# EAGLE design SEM V1 (EAGLE 9.6.2)
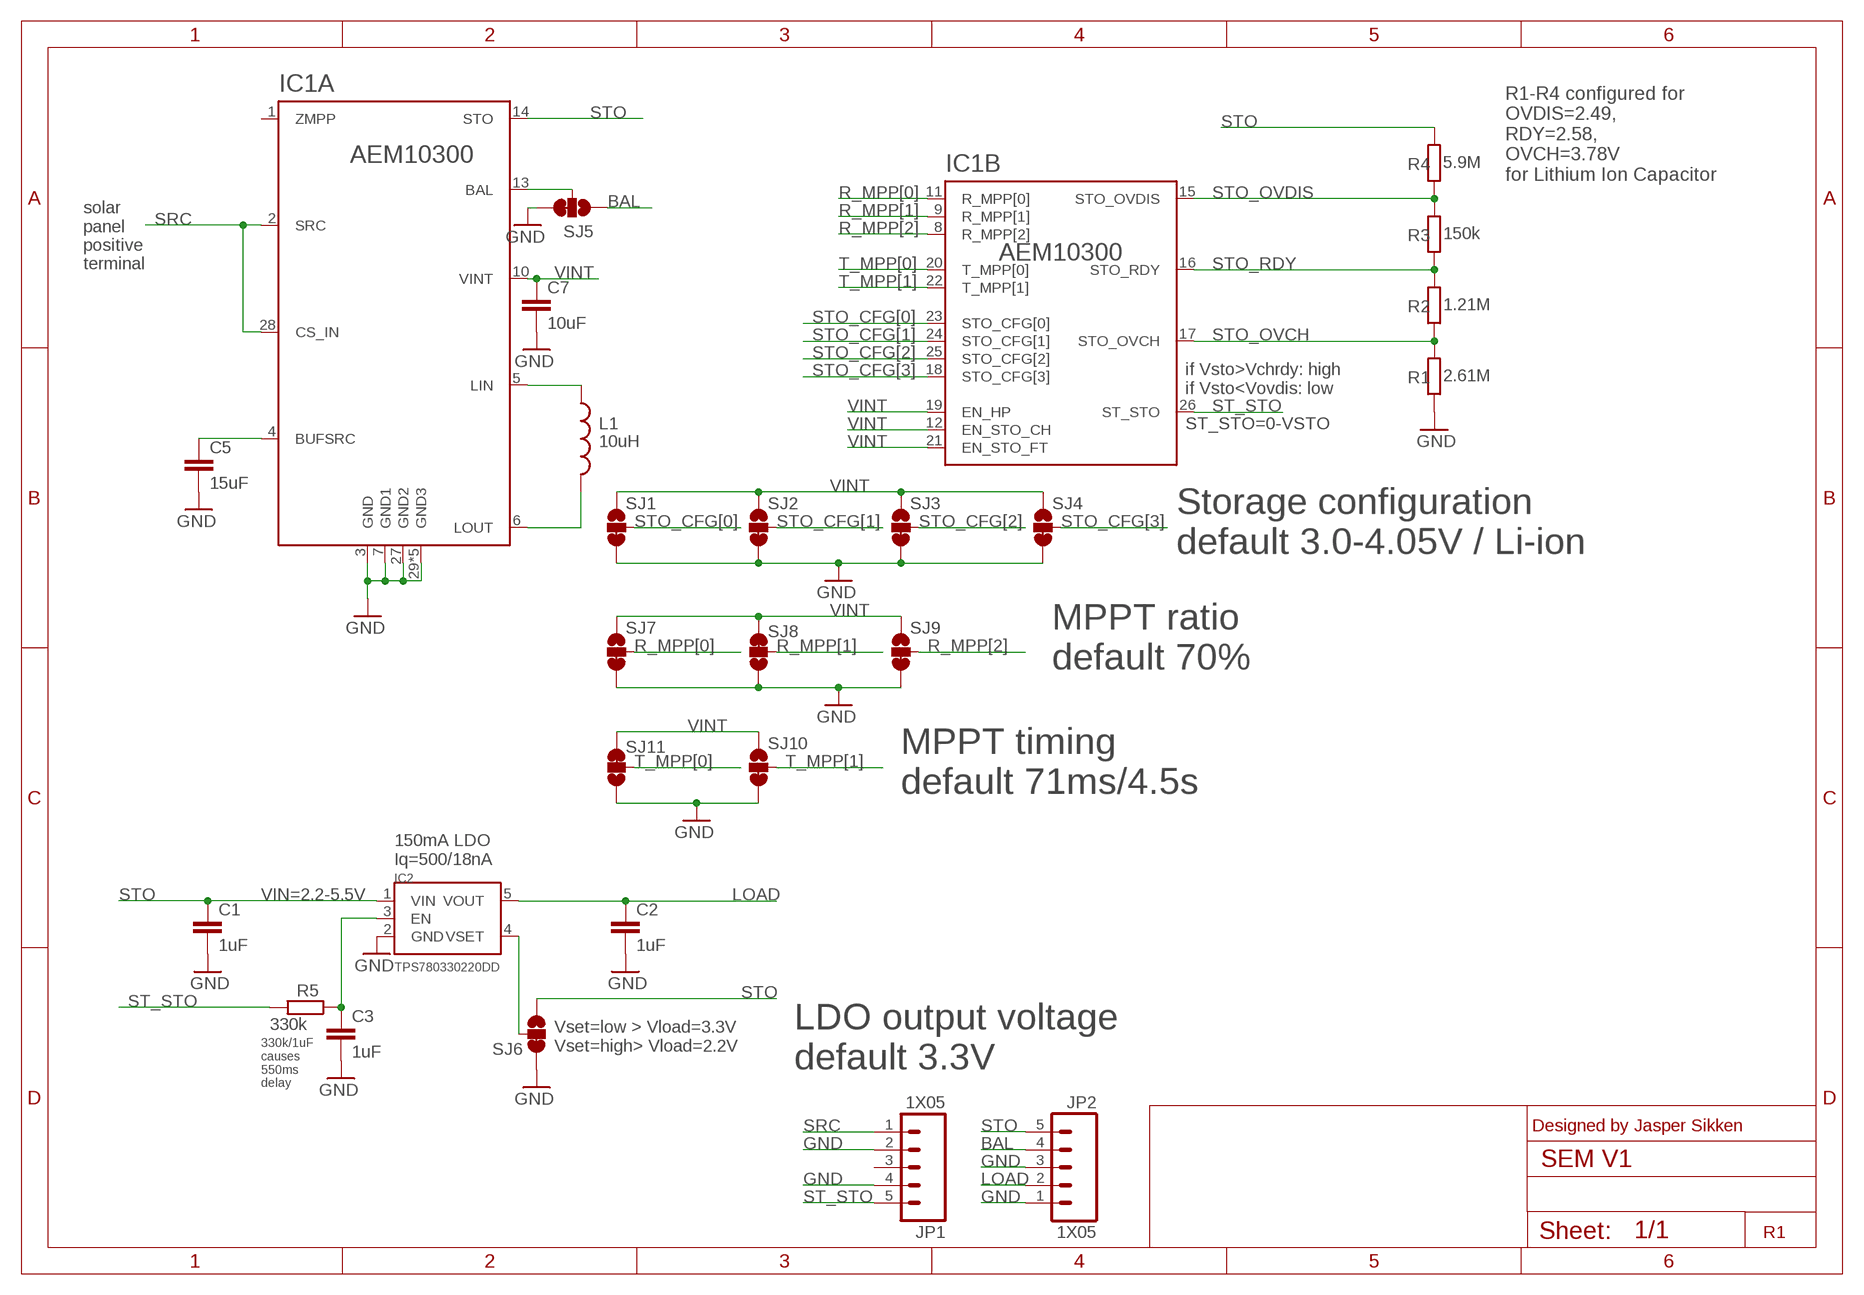
[diagram p0: schematic, sheet 1]

## Parts
C1  1uF  C0402_1UF  [C0402]
C2  1uF  C0402_1UF  [C0402]
C3  1uF  C_0402  [C0402]
C5  15uF  C_0402  [C0402]
C7  10uF  C_0402  [C0402]
IC1  AEM10300  [QFN28P4X4]
IC2  TPS780330220DD  [SOT23-5]
JP1  1X05  [1X05_2.54MM_ROUND_NOSILK]
JP2  1X05  [1X05_2.54MM_ROUND_NOSILK]
L1  10uH  L  [L_1008_[2520]]
R1  2.61M  R0402_1M  [R0402]
R2  1.21M  R0402_1M  [R0402]
R3  150k  R0402_1M  [R0402]
R4  5.9M  R0402_1M  [R0402]
R5  330k  R0402_1M  [R0402]
SJ1  SOLDERJUMPER_3WAY_12SHORT3WAY  [SJ_3S_NC_0402]
SJ2  SOLDERJUMPER_3WAY_12SHORT3WAY  [SJ_3S_NC_0402]
SJ3  SOLDERJUMPER_3WAY_12SHORT3WAY  [SJ_3S_NC_0402]
SJ4  SOLDERJUMPER_3WAY_12SHORT3WAY  [SJ_3S_NC_0402]
SJ5  SOLDERJUMPER_3WAY_12SHORT3WAY  [SJ_3S_NC_0402]
SJ6  SOLDERJUMPER_3WAY_12SHORT3WAY  [SJ_3S_NC_0402]
SJ7  SOLDERJUMPER_3WAY_12SHORT3WAY  [SJ_3S_NC_0402]
SJ8  SOLDERJUMPER_3WAY_12SHORT3WAY  [SJ_3S_NC_0402]
SJ9  SOLDERJUMPER_3WAY_12SHORT3WAY  [SJ_3S_NC_0402]
SJ10  SOLDERJUMPER_3WAY_12SHORT3WAY  [SJ_3S_NC_0402]
SJ11  SOLDERJUMPER_3WAY_12SHORT3WAY  [SJ_3S_NC_0402]

## Nets
AEM_BAL: IC1.13(A:BAL) SJ5.2
BAL: JP2.4 SJ5.3
BUFSRC: C5.1 IC1.4(A:BUFSRC)
EN: C3.1 IC2.3(EN) R5.1
GND: C1.2 C2.2 C3.2 C5.2 C7.2 IC1.3(A:GND) IC1.7(A:GND1) IC1.27(A:GND2) IC1.29(A:GND3) IC1.P$1(A:GND3) IC1.P$2(A:GND3) IC1.P$3(A:GND3) IC1.P$4(A:GND3) IC2.2(GND) JP1.2 JP1.4 JP2.1 JP2.3 R1.1 SJ1.1 SJ2.1 SJ3.1 SJ4.1 SJ5.1 SJ6.1 SJ7.1 SJ8.3 SJ9.1 SJ10.1 SJ11.3
LIN: IC1.5(A:LIN) L1.1
LOAD: C2.1 IC2.5(VOUT) JP2.2
LOUT: IC1.6(A:LOUT) L1.2
R_MPP[0]: IC1.11(B:R_MPP[0]) SJ7.2
R_MPP[1]: IC1.9(B:R_MPP[1]) SJ8.2
R_MPP[2]: IC1.8(B:R_MPP[2]) SJ9.2
SRC: IC1.2(A:SRC) IC1.28(A:CS_IN) JP1.1
ST_STO: IC1.26(B:ST_STO) JP1.5 R5.2
STO: C1.1 IC1.14(A:STO) IC2.1(VIN) JP2.5 R4.2 SJ6.3
STO_CFG[0]: IC1.23(B:STO_CFG[0]) SJ1.2
STO_CFG[1]: IC1.24(B:STO_CFG[1]) SJ2.2
STO_CFG[2]: IC1.25(B:STO_CFG[2]) SJ3.2
STO_CFG[3]: IC1.18(B:STO_CFG[3]) SJ4.2
STO_OVCH: IC1.17(B:STO_OVCH) R1.2 R2.1
STO_OVDIS: IC1.15(B:STO_OVDIS) R3.2 R4.1
STO_RDY: IC1.16(B:STO_RDY) R2.2 R3.1
T_MPP[0]: IC1.20(B:T_MPP[0]) SJ11.2
T_MPP[1]: IC1.22(B:T_MPP[1]) SJ10.2
VINT: C7.1 IC1.10(A:VINT) IC1.12(B:EN_STO_CH) IC1.19(B:EN_HP) IC1.21(B:EN_STO_FT) SJ1.3 SJ2.3 SJ3.3 SJ4.3 SJ7.3 SJ8.1 SJ9.3 SJ10.3 SJ11.1
VSET: IC2.4(VSET) SJ6.2
Unconnected: IC1.1(A:ZMPP) JP1.3

## Notes on the sheet
- R1-R4 configured for 
  OVDIS=2.49,
  RDY=2.58,
  OVCH=3.78V
  for Lithium Ion Capacitor
- solar
  panel
  positive
  terminal
- if Vsto>Vchrdy: high
  if Vsto<Vovdis: low
- ST_STO=0-VSTO
- Storage configuration
  default 3.0-4.05V / Li-ion
- MPPT ratio
  default 70%
- MPPT timing
  default 71ms/4.5s
- 150mA LDO 
  Iq=500/18nA
- VIN=2.2-5.5V
- Vset=low > Vload=3.3V
  Vset=high> Vload=2.2V
- LDO output voltage
  default 3.3V
- 330k/1uF 
  causes 
  550ms 
  delay
- Designed by Jasper Sikken
- R1

## Library data of the parts
C1 C2 = TSEM:C: Non-polarized capacitor; FARNELL_OC: 2672103
C3 C5 C7 = TSEM:C: Non-polarized capacitor
IC1 = TSEM:AEM10300: Ambient Energy Manager from e-peas
IC2 = TSEM:TPS780330220DD
JP1 JP2 = TSEM:1X05; OC_NEWARK: unknown
L1 = TSEM:L: Inductor; MF: MURATA; MPN: DFE252010F-100
R1-R5 = TSEM:R: Resistor; FARNELL_OC: 2502499; OC_NEWARK: unknown; VALUE: 1M
SJ1-SJ11 = sodaq:SOLDERJUMPER_3WAY_12SHORT; OC_NEWARK: unknown

## Board
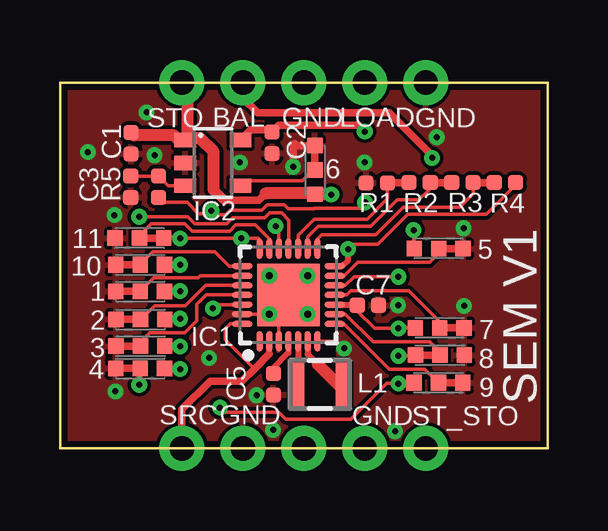
[diagram p1: board, top side]
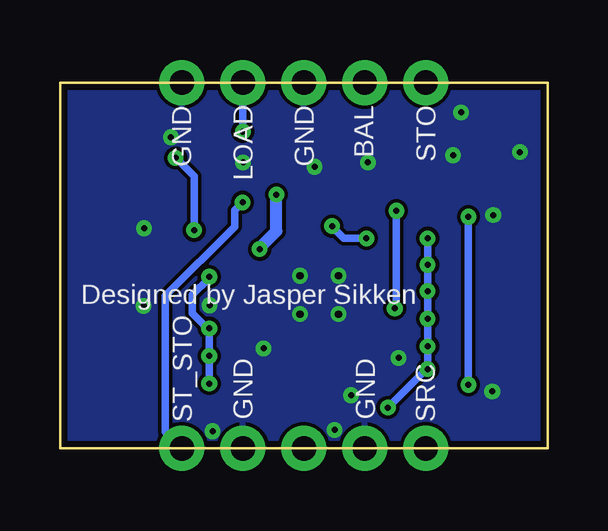
[diagram p2: board, bottom side, seen from below]

Size 20.32 x 15.24 mm. Coordinates in mm from the lower left corner, seen from the top.
Outline: 0,0 0,15.24 20.32,15.24 20.32,0 0,0
Copper layers (1*16): Top 0.018mm / dielectric 1.55mm / Bottom 0.018mm
Design rules "eC_2Layer_PClass6_BaseCopperO18_eCDefault *": minimum track width 0.15mm, minimum drill 0.25mm, track to track 0.15mm, track to pad 0.15mm, pad to pad 0.15mm, via to via 0.15mm, smd to smd 0mil, copper to edge 0.25mm, drill to drill 0.35mm, minimum pad ring 0.175mm, minimum via ring 0.125mm, stop-mask expansion 0.03mm, vias tented up to drill 0.45mm, thermal gap 0.15mm
tRestrict: area 10.6,3.5 to 11.4,4.9

### Footprints (pad centres in the part's own frame; a part is rotated, then mirrored left to right if it is on the bottom)
C0402 = smd 0.635 x 0.635: 1 -0.445,0; 2 0.445,0
QFN28P4X4 = smd 0.85 x 0.25: 1 -1.925,1.2; 2 -1.925,0.8; 3 -1.925,0.4; 4 -1.925,0; 5 -1.925,-0.4; 6 -1.925,-0.8; 7 -1.925,-1.2; 15 1.925,-1.2; 16 1.925,-0.8; 17 1.925,-0.4; 18 1.925,0; 19 1.925,0.4; 20 1.925,0.8; 21 1.925,1.2 | smd 0.25 x 0.85: 8 -1.2,-1.925; 9 -0.8,-1.925; 10 -0.4,-1.925; 11 0,-1.925; 12 0.4,-1.925; 13 0.8,-1.925; 14 1.2,-1.925; 22 1.2,1.925; 23 0.8,1.925; 24 0.4,1.925; 25 0,1.925; 26 -0.4,1.925; 27 -0.8,1.925; 28 -1.2,1.925 | smd 2.6 x 2.6: 29 0,0 | drill 0.3: P$1 -0.8,0.8; P$2 0.8,0.8; P$3 -0.8,-0.8; P$4 0.8,-0.8
SOT23-5 = smd 0.6 x 0.9: 1 -0.95,-1.15; 2 0,-1.15; 3 0.95,-1.15; 4 0.95,1.15; 5 -0.95,1.15
1X05_2.54MM_ROUND_NOSILK = drill 1.016 pad 1.88: 1 0,0; 2 2.54,0; 3 5.08,0; 4 7.62,0; 5 10.16,0
L_1008_[2520] = smd 0.6 x 2: 1 -0.95,0; 2 0.95,0
R0402 = smd 0.635 x 0.635: 1 -0.445,0; 2 0.445,0
SJ_3S_NC_0402 = smd 0.635 x 0.65: 1 -1.016,0; 2 0,0; 3 1.016,0

### Placement (x,y rotation side)
C1  2.96,12.71 270 top
C2  8.84,12.73 270 top
C3  2.95,10.9 270 top
C5  8.89,2.67 270 top
C7  12.83,5.96 0 top
IC1  9.52,6.39 90 top
IC2  6.37,11.89 270 top
JP1  5.08,0 0 top
JP2  15.24,15.24 180 top
L1  10.83,2.66 0 top
R1  13.2,11.06 0 top
R2  14.98,11.07 0 top
R3  16.77,11.07 0 top
R4  18.54,11.07 0 top
R5  4.1,10.9 270 top
SJ1  3.34,6.54 0 top
SJ2  3.35,5.37 0 top
SJ3  3.35,4.26 0 top
SJ4  3.34,3.33 0 top
SJ5  15.78,8.32 180 top
SJ6  10.62,11.6 270 top
SJ7  15.82,5.02 180 top
SJ8  15.83,3.88 0 top
SJ9  15.77,2.73 180 top
SJ10  3.34,7.65 0 top
SJ11  3.31,8.76 180 top

### Tracks (layer width: path | path; a pad name or v marks a point on that pad's centre or on a via)
AEM_BAL
  Top 0.15: IC1.13 11.84,7.19 12.4,7.75 15.4,7.75 15.8,8.15 15.8,8.3 SJ5.2
BAL  (via drill 0.25 pad 0.65)
  Top 0.15: SJ5.3 14.73,8.35 v14.73,9.09 | v15.5,12.1 15.5,12.2
  Top 0.305: 15.5,12.2 13.72,13.98 8.23,13.98 7.62,14.59 JP2.4
  Bottom 0.305: v15.5,12.1 14.73,11.33 v14.73,9.09
BUFSRC
  Top 0.15: 8.84,3.29 8.84,3.16 C5.1
  Top 0.25: IC1.4 9.52,3.97 8.84,3.29
EN
  Top 0.15: C3.1 R5.1 4.5,10.94 IC2.3
GND  (via drill 0.25 pad 0.65)
  Top 0.15: IC1.3 9.12,5.19 IC1.P$1 IC1.27 | IC1.7 11.54,4.46 v11.84,4.16
  Top 0.305: SJ6.1 9.85,12.62 9.78,12.69 9.71,12.62 v9.71,11.73
  other vias: 8.19,2.21 14.09,5.96 3.94,12.21 12.69,11.91 7.49,11.91 2.27,9.72 2.31,2.37 6.21,3.77 13.96,0.71 16.84,5.93 16.82,9.17 8.88,0.77 1.16,12.34 3.61,14 15.7,12.96
  pour Top: 0,15.24 20.32,15.24 20.32,0 0,0
  pour Bottom: 0,15.24 20.32,15.24 20.32,0 0,0
LIN
  Top 0.15: 9.92,2.81 9.87,2.76 L1.1
  Top 0.25: L1.1 | IC1.5 9.92,2.81
LOAD  (via drill 0.25 pad 0.65)
  Top 0.305: IC2.5 7.96,13.27 8.74,13.27 C2.1 9.12,13.45 12.45,13.45 v12.7,13.2
  Bottom 0.305: JP2.2 v12.7,13.2
LOUT
  Top 0.25: 10.75,3.5 10.74,3.5 10.32,3.92 IC1.6
  Top 0.508: 10.74,3.5 11.58,2.66 L1.2
R_MPP[0]
  Top 0.15: IC1.11 11.94,6.39 12.11,6.56 14.54,6.56 15.82,5.28 SJ7.2
R_MPP[1]
  Top 0.15: IC1.9 11.89,5.59 13.05,4.44 15.41,4.44 15.83,4.02 SJ8.2
R_MPP[2]
  Top 0.15: IC1.8 11.82,5.19 13.71,3.3 15.2,3.3 SJ9.2
SRC
  Top 0.15: IC1.28 7.09,5.19 6.89,4.99 6.89,4.51 8.06,3.35 8.12,3.35
  Top 0.25: 8.72,3.94 IC1.2
  Top 0.305: JP1.1 5.08,1.63 6.25,2.8 7.58,2.8 8.12,3.35 8.72,3.94
ST_STO  (via drill 0.25 pad 0.65)
  Top 0.15: IC1.26 6.64,5.99 6.48,5.83 v6.37,5.83 | v12.71,10.25 12.71,10 10.6,10 10.59,9.99 9.5,9.99 9.35,10.14 8.63,10.14 8.41,9.92 7.09,9.92 6.9,9.73 6.47,9.73 v6.3,9.9 6.18,9.78 5.77,9.78 5.3,10.25 4.31,10.25 R5.2
  Bottom 0.305: v6.3,9.9 6.3,5.9 v6.37,5.83 | v12.71,10.25 13.04,9.93 13.04,9.24 15.93,6.35 15.93,0.69 JP1.5
STO  (via drill 0.25 pad 0.65)
  Top 0.15: R4.2 19,11.05 19,11 17.75,9.75 14.49,9.75 13.24,8.5 12.2,8.5 v12,8.3 | 2.91,13.2 C1.1
  Top 0.25: IC1.14 11.74,7.59 12,7.84 v12,8.3 | v11.3,10.57 11.29,10.58
  Top 0.305: JP2.5 5.3,15.02 | SJ6.3 | 8.56,10.62 8.27,10.34 6.84,10.34
  Top 0.406: 6.84,10.34 6.4,10.78
  Top 0.508: 11.29,10.58 SJ6.3 10.58,10.62 8.56,10.62 | 5.3,12.93 IC2.1 4.94,12.84 4.75,13.04 3.08,13.04 C1.1 | 5.3,15.02 5.3,12.93 | 5.3,12.93 5.83,12.93 6.4,12.35 6.4,10.78
  Bottom 0.508: v12,8.3 12,8.35 11.3,9.05 v11.3,10.57
STO_CFG[0]
  Top 0.15: IC1.23 5.85,7.19 5.76,7.1 3.9,7.1 SJ1.2
STO_CFG[1]
  Top 0.15: 7.45,6.79 6.07,6.79 5.23,5.95 3.94,5.95 SJ2.2
  Top 0.25: IC1.24 7.45,6.79
STO_CFG[2]
  Top 0.15: SJ3.2 3.34,4.27 3.34,4.42 3.73,4.82 5.2,4.82 5.7,5.32 5.7,6 6.09,6.39 IC1.25
STO_CFG[3]  (via drill 0.25 pad 0.65)
  Top 0.15: v3.3,2.65 3.34,2.69 SJ4.2 | IC1.18 9.54,8.34 9.54,9.51 9.23,9.82 8.74,9.82 8.53,9.61 7.21,9.61 6.95,9.35 5.62,9.35 5.32,9.65 v3.3,9.65
  Bottom 0.305: v3.3,9.65 v3.3,2.65
STO_OVCH
  Top 0.15: IC1.17 9.92,8.87 10.6,9.55 12.8,9.55 13.64,10.39 R1.2 13.65,11.07
  Top 0.305: R2.1 13.65,11.07
STO_OVDIS
  Top 0.15: IC1.15 10.72,8.71 10.9,8.9 13.16,8.9 14.31,10.05 16.65,10.05 17.21,10.61 R3.2
  Top 0.305: R3.2 R4.1
STO_RDY
  Top 0.15: IC1.16 10.32,8.82 10.75,9.25 12.95,9.25 14.05,10.35 14.95,10.35 15.43,10.82 R2.2 15.43,10.93
  Top 0.305: R2.2 R3.1
T_MPP[0]
  Top 0.15: IC1.20 8.72,8.73 8.14,9.31 7.33,9.31 7.07,9.05 5.5,9.05 5.2,9.35 3.8,9.35 3.31,8.86 SJ11.2
T_MPP[1]
  Top 0.15: IC1.22 7.06,7.59 6.45,8.2 3.88,8.2 3.34,7.67 SJ10.2
VINT  (via drill 0.25 pad 0.65)
  Top 0.15: 12.36,5.99 C7.1 12.39,5.72 13.11,5 v14.1,5 14.12,5.02 SJ7.3 | IC1.12 11.89,6.79 12.25,7.15 v14.1,7.15 | SJ9.3 14.72,2.7 v14.1,2.7 14.08,2.72 13.62,2.72 12.12,1.22 9.4,1.22 9.12,1.5 6.86,1.5 v6.66,1.7 | SJ8.1 14.78,3.85 v14.1,3.85 | SJ4.3 4.97,3.33 v5,3.3 | v5,4.25 v4.99,4.26 SJ3.3 | v5,5.4 4.4,5.4 SJ2.3 | SJ1.3 v5,6.55 | v5,7.65 SJ10.3 | SJ11.1 4.38,8.81 4.94,8.81 v5,8.75 v7.55,8.75 8.25,8.75 8.32,8.68 IC1.21 | IC1.19 9.12,9.12 v8.98,9.26
  Top 0.25: IC1.10 12.36,5.99
  Bottom 0.15: v8.98,9.26 8.98,9.23 | v5,3.3 5.06,3.3 | v14.1,5 14.18,5
  Bottom 0.305: v14.1,2.7 v14.1,3.85 v14.1,5 | v5,3.3 v5,4.25 v5,5.4 v5,6.55 v5,7.65 v5,8.75 | 8.98,9.23 8.5,8.75 v7.55,8.75 | v6.66,1.7 5.06,3.3 | 14.18,5 14.8,5.62 14.8,6.39 14.1,7.09 v14.1,7.15
VSET
  Top 0.15: IC2.4 7.72,11.14 10.09,11.14 10.59,11.63 SJ6.2

### Text on the board
tPlace: STO | BAL | GND | LOAD | GND | 6 | 11 | 5 | 10 | 1 | 2 | 7 | 3 | 4 | 8 | 9 | SEM V1 | SRC | GND | GND | ST_STO
bPlace: STO | BAL | GND | LOAD | GND | Designed by Jasper Sikken | SRC | GND | GND | ST_STO